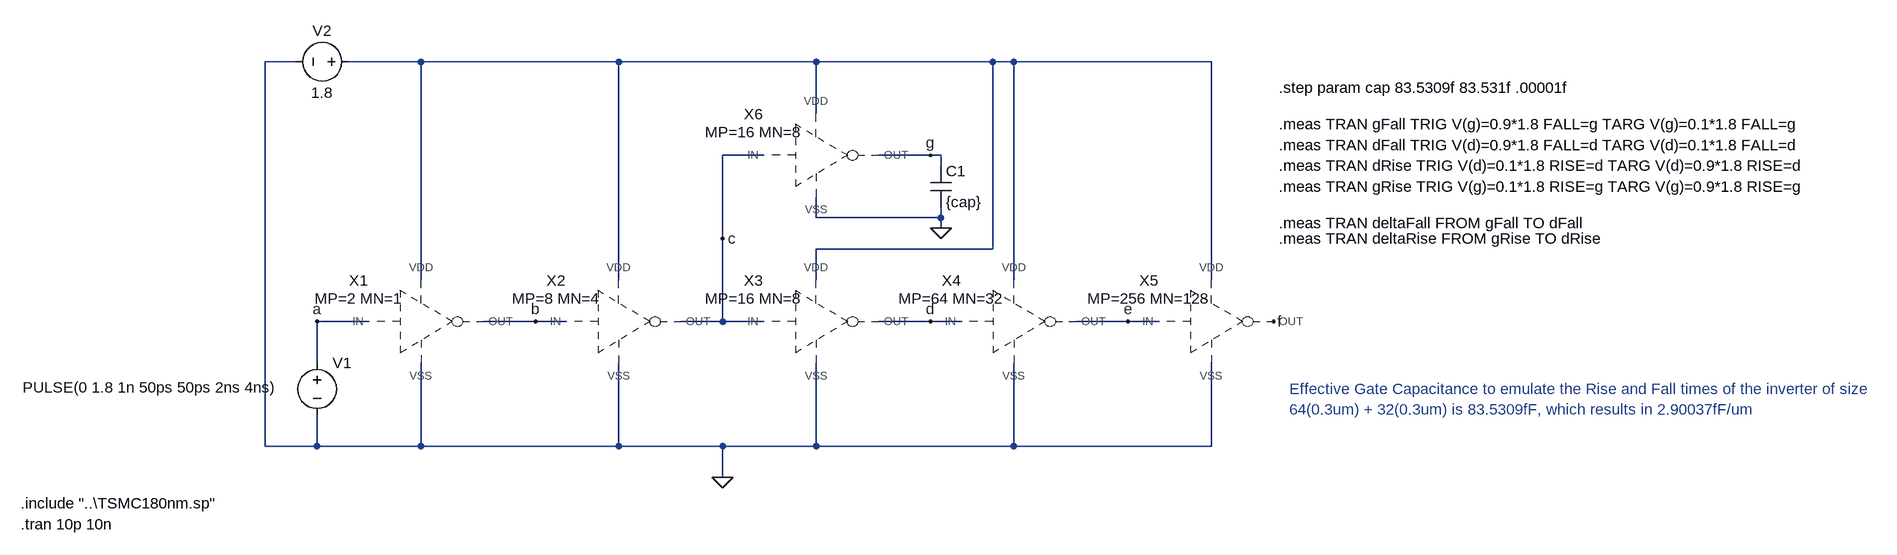
[diagram p0: schematic Problem_2-Effective_Gate_Capacitance.asc]
Problem_2-Effective_Gate_Capacitance.asc, the LTspice schematic file:
Version 4
SHEET 1 2620 680
WIRE -128 -224 -176 -224
WIRE 64 -224 -48 -224
WIRE 368 -224 64 -224
WIRE 672 -224 368 -224
WIRE 944 -224 672 -224
WIRE 976 -224 944 -224
WIRE 1280 -224 976 -224
WIRE 672 -144 672 -224
WIRE 592 -80 528 -80
WIRE 848 -80 768 -80
WIRE 864 -80 848 -80
WIRE 864 -64 864 -80
WIRE 672 16 672 -16
WIRE 864 16 864 0
WIRE 864 16 672 16
WIRE 864 32 864 16
WIRE 528 48 528 -80
WIRE 944 64 944 -224
WIRE 944 64 672 64
WIRE 64 112 64 -224
WIRE 368 112 368 -224
WIRE 672 112 672 64
WIRE 976 112 976 -224
WIRE 1280 112 1280 -224
WIRE -16 176 -96 176
WIRE 240 176 160 176
WIRE 288 176 240 176
WIRE 528 176 528 48
WIRE 528 176 464 176
WIRE 592 176 528 176
WIRE 848 176 768 176
WIRE 896 176 848 176
WIRE 1152 176 1072 176
WIRE 1200 176 1152 176
WIRE -96 240 -96 176
WIRE -176 368 -176 -224
WIRE -96 368 -96 320
WIRE -96 368 -176 368
WIRE 64 368 64 240
WIRE 64 368 -96 368
WIRE 368 368 368 240
WIRE 368 368 64 368
WIRE 528 368 368 368
WIRE 672 368 672 240
WIRE 672 368 528 368
WIRE 976 368 976 240
WIRE 976 368 672 368
WIRE 1280 368 1280 240
WIRE 1280 368 976 368
WIRE 528 416 528 368
FLAG 528 416 0
FLAG 864 32 0
FLAG -96 176 a
FLAG 240 176 b
FLAG 528 48 c
FLAG 848 176 d
FLAG 1152 176 e
FLAG 1376 176 f
FLAG 848 -80 g
SYMBOL INV -16 176 R0
WINDOW 39 -16 -20 Bottom 2
SYMATTR SpiceLine MP=2 MN=1
SYMATTR InstName X1
SYMBOL INV 288 176 R0
WINDOW 39 -16 -20 Bottom 2
SYMATTR SpiceLine MP=8 MN=4
SYMATTR InstName X2
SYMBOL INV 592 176 R0
WINDOW 39 -16 -20 Bottom 2
SYMATTR SpiceLine MP=16 MN=8
SYMATTR InstName X3
SYMBOL INV 896 176 R0
WINDOW 39 -16 -20 Bottom 2
SYMATTR SpiceLine MP=64 MN=32
SYMATTR InstName X4
SYMBOL INV 1200 176 R0
WINDOW 39 -16 -20 Bottom 2
SYMATTR SpiceLine MP=256 MN=128
SYMATTR InstName X5
SYMBOL INV 592 -80 R0
WINDOW 39 -16 -20 Bottom 2
SYMATTR SpiceLine MP=16 MN=8
SYMATTR InstName X6
SYMBOL voltage -32 -224 R90
WINDOW 0 -32 56 VBottom 2
WINDOW 3 32 56 VTop 2
WINDOW 123 0 0 Left 0
WINDOW 39 0 0 Left 0
SYMATTR InstName V2
SYMATTR Value 1.8
SYMBOL voltage -96 224 R0
WINDOW 3 -453 53 Left 2
WINDOW 123 0 0 Left 0
WINDOW 39 0 0 Left 0
SYMATTR Value PULSE(0 1.8 1n 50ps 50ps 2ns 4ns)
SYMATTR InstName V1
SYMBOL cap 848 -64 R0
SYMATTR InstName C1
SYMATTR Value {cap}
TEXT -552 456 Left 2 !.include "..\\TSMC180nm.sp"
TEXT -552 488 Left 2 !.tran 10p 10n
TEXT 1384 -96 Left 2 !.meas TRAN dFall TRIG V(d)=0.9*1.8 FALL=d TARG V(d)=0.1*1.8 FALL=d
TEXT 1384 -64 Left 2 !.meas TRAN dRise TRIG V(d)=0.1*1.8 RISE=d TARG V(d)=0.9*1.8 RISE=d
TEXT 1384 -32 Left 2 !.meas TRAN gRise TRIG V(g)=0.1*1.8 RISE=g TARG V(g)=0.9*1.8 RISE=g
TEXT 1384 -128 Left 2 !.meas TRAN gFall TRIG V(g)=0.9*1.8 FALL=g TARG V(g)=0.1*1.8 FALL=g
TEXT 1384 24 Left 2 !.meas TRAN deltaFall FROM gFall TO dFall
TEXT 1384 48 Left 2 !.meas TRAN deltaRise FROM gRise TO dRise
TEXT 1384 -184 Left 2 !.step param cap 83.5309f 83.531f .00001f
TEXT 1400 280 Left 2 ;Effective Gate Capacitance to emulate the Rise and Fall times of the inverter of size \n64(0.3um) + 32(0.3um) is 83.5309fF, which results in 2.90037fF/um

The netlist it stands for:
* Problem_2-Effective_Gate_Capacitance.asc
XX1 a b N001 0 INV params: MP=2 MN=1  ; pins IN OUT VDD VSS
XX2 b c N001 0 INV params: MP=8 MN=4  ; pins IN OUT VDD VSS
XX3 c d N001 0 INV params: MP=16 MN=8  ; pins IN OUT VDD VSS
XX4 d e N001 0 INV params: MP=64 MN=32  ; pins IN OUT VDD VSS
XX5 e f N001 0 INV params: MP=256 MN=128  ; pins IN OUT VDD VSS
XX6 c g N001 0 INV params: MP=16 MN=8  ; pins IN OUT VDD VSS
V2 N001 0 1.8
V1 a 0 PULSE(0 1.8 1n 50ps 50ps 2ns 4ns)
C1 g 0 {cap}
.include "..\TSMC180nm.sp"
.tran 10p 10n
.meas TRAN dFall TRIG V(d)=0.9*1.8 FALL=d TARG V(d)=0.1*1.8 FALL=d
.meas TRAN dRise TRIG V(d)=0.1*1.8 RISE=d TARG V(d)=0.9*1.8 RISE=d
.meas TRAN gRise TRIG V(g)=0.1*1.8 RISE=g TARG V(g)=0.9*1.8 RISE=g
.meas TRAN gFall TRIG V(g)=0.9*1.8 FALL=g TARG V(g)=0.1*1.8 FALL=g
.meas TRAN deltaFall FROM gFall TO dFall
.meas TRAN deltaRise FROM gRise TO dRise
.step param cap 83.5309f 83.531f .00001f
* Effective Gate Capacitance to emulate the Rise and Fall times of the inverter of size
* 64(0.3um) + 32(0.3um) is 83.5309fF, which results in 2.90037fF/um
.backanno
.end